# EasyEDA schematic 1-Schematic_VineBox.json
TITLE: VineBox; REV: 2.0; Date: 2019-12-05; Sheet: 1/1; Drawn By: Lagodish; Company: Lagodish inc.
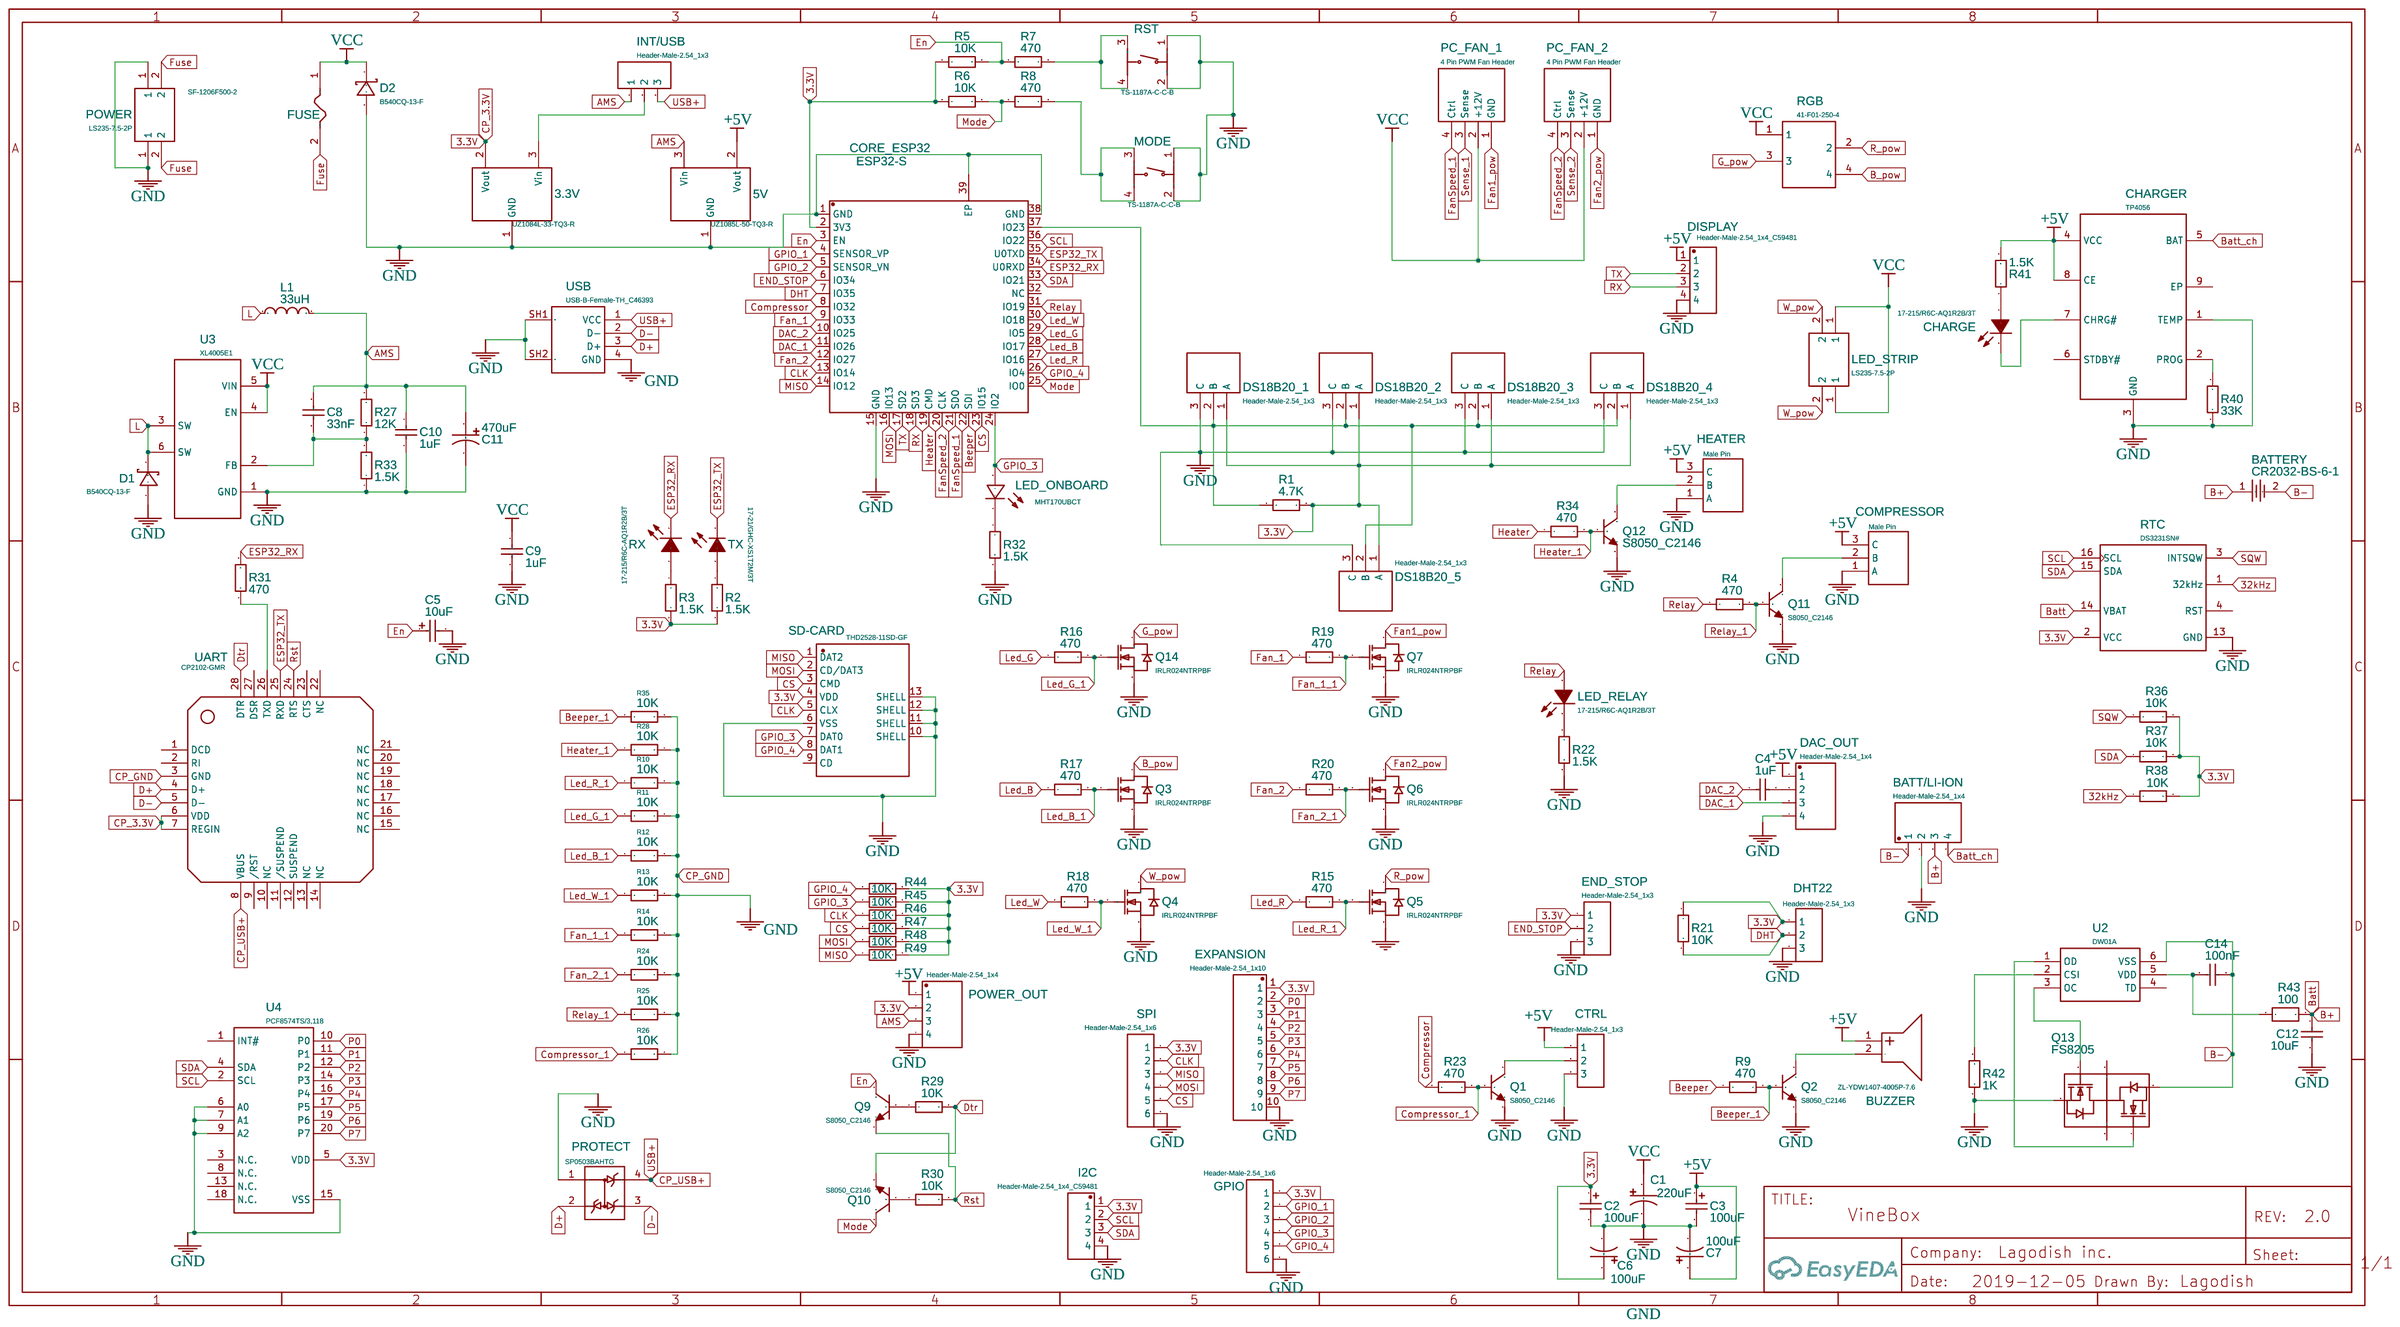
[diagram p0: schematic sheet]

## Parts
3.3V  UZ1084L-33-TQ3-R  [TO-263-3_L8.6-W10.2-P2.54-LS14.4-BR]
5V  UZ1085L-50-TQ3-R  [TO-263-3_L8.6-W10.2-P2.54-LS14.4-BR]
BATT/LI-ION  Header-Male-2.54_1x4  [210S-1X4P]
BATTERY  CR2032-BS-6-1  [BAT-TH_CR2032-BS-6-1]
BUZZER  ZL-YDW1407-4005P-7.6  [BUZ-TH_BD14.0-P7.60-D0.7-FD]
C1  220uF  [CAP-SMD_BD10.0-L10.3-W10.3-FD]
C2  100uF  [CAP-SMD_L3.5-W2.8]
C3  100uF  [CAP-SMD_L3.5-W2.8]
C4  1uF  [0805]
C5  10uF  [CAP-SMD_L3.2-W1.6-R-RD]
C6  100uF  [CAP-SMD_BD6.3-L6.6-W6.6-FD]
C7  100uF  [CAP-SMD_BD6.3-L6.6-W6.6-FD]
C8  33nF  [0805]
C9  1uF  [0805]
C10  1uF  [0805]
C11  470uF  [CAP-SMD_BD10.0-L10.3-W10.3-FD]
C12  10uF  [0805]
C14  100nF  [0805]
CHARGE  17-215/R6C-AQ1R2B/3T  [LED0805-R-RD]
CHARGER  TP4056  [ESOP-8_L4.9-W3.9-P1.27-LS6.0-BL-EP]
COMPRESSOR  Male Pin  [3 PIN HEADER]
CORE_ESP32  ESP32-S  [ESP32-S]
CTRL  Header-Male-2.54_1x3  [HDR-TH_3P-P2.54-V]
D1  B540CQ-13-F  [SMC_L6.9-W5.9-LS7.9-RD]
D2  B540CQ-13-F  [SMC_L6.9-W5.9-LS7.9-RD]
DAC_OUT  Header-Male-2.54_1x4  [210S-1X4P]
DHT22  Header-Male-2.54_1x3  [HDR-TH_3P-P2.54-V]
DISPLAY  Header-Male-2.54_1x4_C59481  [HDR-TH_4P-P2.54-V]
DS18B20_1  Header-Male-2.54_1x3  [3 PIN HEADER]
DS18B20_2  Header-Male-2.54_1x3  [3 PIN HEADER]
DS18B20_3  Header-Male-2.54_1x3  [3 PIN HEADER]
DS18B20_4  Header-Male-2.54_1x3  [3 PIN HEADER]
DS18B20_5  Header-Male-2.54_1x3  [3 PIN HEADER]
END_STOP  Header-Male-2.54_1x3  [HDR-TH_3P-P2.54-V]
EXPANSION  Header-Male-2.54_1x10  [HDR-TH_10P-P2.54-V]
FUSE  SF-1206F500-2  [1206]
GPIO  Header-Male-2.54_1x6  [HDR-TH_6P-P2.54-V]
HEATER  Male Pin  [3 PIN HEADER]
I2C  Header-Male-2.54_1x4_C59481  [HDR-TH_4P-P2.54-V]
INT/USB  Header-Male-2.54_1x3  [HDR-TH_3P-P2.54-V]
L1  33uH  [IND-SMD_L12.5-W12.5]
LED_ONBOARD  MHT170UBCT  [LED0805-RD]
LED_RELAY  17-215/R6C-AQ1R2B/3T  [LED0805-R-RD]
LED_STRIP  LS235-7.5-2P  [CON-TH_2P_LS235-7.5-2P]
MODE  TS-1187A-C-C-B  [SW-SMD_4P-L5.1-W5.1-P3.70-LS6.4]
PC_FAN_1  4 Pin PWM Fan Header  [4 PIN PWM FAN HEADER]
PC_FAN_2  4 Pin PWM Fan Header  [4 PIN PWM FAN HEADER]
POWER  LS235-7.5-2P  [CON-TH_2P_LS235-7.5-2P]
POWER_OUT  Header-Male-2.54_1x4  [210S-1X4P]
PROTECT  SP0503BAHTG  [SOT-143_4PIN_L3.05-W2.64-PITCH1.92-BR]
Q1  S8050_C2146  [SOT-23-3_L3.0-W1.7-P0.95-LS2.9-BR]
Q2  S8050_C2146  [SOT-23-3_L3.0-W1.7-P0.95-LS2.9-BR]
Q3  IRLR024NTRPBF  [TO-252-2]
Q4  IRLR024NTRPBF  [TO-252-2]
Q5  IRLR024NTRPBF  [TO-252-2]
Q6  IRLR024NTRPBF  [TO-252-2]
Q7  IRLR024NTRPBF  [TO-252-2]
Q9  S8050_C2146  [SOT-23-3_L3.0-W1.7-P0.95-LS2.9-BR]
Q10  S8050_C2146  [SOT-23-3_L3.0-W1.7-P0.95-LS2.9-BR]
Q11  S8050_C2146  [SOT-23-3_L3.0-W1.7-P0.95-LS2.9-BR]
Q12  S8050_C2146  [SOT-23-3_L3.0-W1.7-P0.95-LS2.9-BR]
Q13  FS8205  [SOT-23-6]
Q14  IRLR024NTRPBF  [TO-252-2]
R1  4.7K  [0805]
R2  1.5K  [0805]
R3  1.5K  [0805]
R4  470  [0805]
R5  10K  [0805]
R6  10K  [0805]
R7  470  [0805]
R8  470  [0805]
R9  470  [0805]
R10  10K  [0805]
R11  10K  [0805]
R12  10K  [0805]
R13  10K  [0805]
R14  10K  [0805]
R15  470  [0805]
R16  470  [0805]
R17  470  [0805]
R18  470  [0805]
R19  470  [0805]
R20  470  [0805]
R21  10K  [0805]
R22  1.5K  [0805]
R23  470  [0805]
R24  10K  [0805]
R25  10K  [0805]
R26  10K  [0805]
R27  12K  [0805]
R28  10K  [0805]
R29  10K  [0805]
R30  10K  [0805]
R31  470  [0805]
R32  1.5K  [0805]
R33  1.5K  [0805]
R34  470  [0805]
R35  10K  [0805]
R36  10K  [0805]
R37  10K  [0805]
R38  10K  [0805]
R40  33K  [0805]
R41  1.5K  [0805]
R42  1K  [0805]
R43  100  [RES_1206]
R44  10K  [0805]
R45  10K  [0805]
R46  10K  [0805]
R47  10K  [0805]
R48  10K  [0805]
R49  10K  [0805]
RGB  41-F01-250-4  [CONN-TH_41-F01-250-4]
RST  TS-1187A-C-C-B  [SW-SMD_4P-L5.1-W5.1-P3.70-LS6.4]
RTC  DS3231SN#  [SOIC-16_300MIL]
RX  17-215/R6C-AQ1R2B/3T  [LED0805-R-RD]
SD-CARD  THD2528-11SD-GF  [TF-SMD_9PIN_THD2528-11SD-GF_PITCH1.1-TR]
SPI  Header-Male-2.54_1x6  [HDR-TH_6P-P2.54-V]
TX  17-21/GHC-XS1T2M/3T  [LED0805-R-RD]
U2  DW01A  [SOT-23-6]
U3  XL4005E1  [TO-263-5]
U4  PCF8574TS/3,118  [SSOP-20_20PIN-L6.60-W6.60-PITCH0.65-BL]
UART  CP2102-GMR  [QFN-28_5X5X05P]
USB  USB-B-Female-TH_C46393  [USB-B_4PIN-FEMALE_BF90]

## Library data of the parts
3.3V = -: Supplier: LCSC; Manufacturer: UTC; image: //image.lceda.cn/szlcsc/C75489.jpg; Supplier Part: C75489; LCSC Assembly: Yes; SMT Type: Extend
5V = -: Supplier: LCSC; Manufacturer: UTC; image: //image.lceda.cn/szlcsc/C75492.jpg; Supplier Part: C75492; LCSC Assembly: Yes; SMT Type: Extend
BATT/LI-ION DAC_OUT POWER_OUT = -: Supplier: LCSC; Manufacturer: Ckmtw; Manufacturer Part: 210S-1*4P L=11.6MMGold-plated black; Contributor: LCSC; Supplier Part: C124378
BATTERY = -: Supplier: LCSC; Manufacturer: Q&J; image: //image.lceda.cn/szlcsc/C70377.jpg; Supplier Part: C70377
BUZZER = -: Supplier: LCSC; Supplier Part: C219740; Manufacturer: ZLFY; Contributor: LCSC
C1 = OVG221M1E1010-TRO: Supplier: LCSC; Supplier Part: C250054; Manufacturer: Lelon; Contributor: LCSC
C2 C3 = TAJB107K006RNJ: Supplier: LCSC; Manufacturer: AVX; LCSC Assembly: Yes; Supplier Part: C16133; SMT Type: Basic
C4 C9 C10 = CL21B105KBFNNNE: Supplier: LCSC; Manufacturer: SAMSUNG; LCSC Assembly: Yes; Supplier Part: C28323; SMT Type: Basic
C5 = TAJA106K016RNJ: Supplier: LCSC; Manufacturer: AVX; LCSC Assembly: Yes; Supplier Part: C7171; SMT Type: Basic
C6 C7 = OCV101M0JTR-0606: Supplier: LCSC; Manufacturer: LELON; Contributor: LCSC; Supplier Part: C134854
C8 = 0805B333K500NT: Supplier: LCSC; Manufacturer: FH; LCSC Assembly: Yes; Supplier Part: C1739; SMT Type: Basic
C11 = OVZ471M1A1008-TRO: Supplier: LCSC; Supplier Part: C250114; Manufacturer: Lelon; Contributor: LCSC
C12 = CL21A106KAYNNNE: Supplier: LCSC; Manufacturer: SAMSUNG; LCSC Assembly: Yes; Supplier Part: C15850; SMT Type: Basic
C14 = CL21B104KCFNNNE: Supplier: LCSC; Manufacturer: SAMSUNG; Supplier Part: C28233; LCSC Assembly: Yes; SMT Type: Extend
CHARGE LED_RELAY RX = -: Supplier: LCSC; Manufacturer: EVERLIGHT; Supplier Part: C86865; LCSC Assembly: Yes; SMT Type: Extend
CHARGER = -: Contributor: Guest; Supplier: LCSC; Manufacturer: TOPPOWER; LCSC Assembly: Yes; image: //image.lceda.cn/szlcsc/C16581.jpg; Supplier Part: C16581; SMT Type: Basic
COMPRESSOR DS18B20_1-DS18B20_5 HEATER = -: Manufacturer Part: 3 pin header; Contributor: Deimoss; Supplier Part: C49257
CORE_ESP32 = -: Supplier: LCSC; Supplier Part: C277944; Manufacturer: Ai-Thinker; Contributor: LCSC
CTRL DHT22 END_STOP INT/USB = -: Supplier: LCSC; Manufacturer: BOOMELE; Manufacturer Part: Header2.54mm 1*3P; image: //image.lceda.cn/szlcsc/C49257.jpg; Supplier Part: C49257
D1 D2 = -: Supplier Part: C105556; Supplier: LCSC; Manufacturer: DIODES; Contributor: LCSC; LCSC Assembly: Yes; SMT Type: Extend
DISPLAY I2C = -: Supplier: LCSC; Manufacturer: ReliaPro; Manufacturer Part: Headers  Pins 1*4P; image: http://image.lceda.cn/szlcsc/C59481.jpg; Supplier Part: C124378
EXPANSION = -: Supplier: LCSC; Manufacturer Part: Headers  Pins2.54mm1*10P; image: http://image.lceda.cn/szlcsc/C57369.jpg; Supplier Part: C57369
FUSE = -: Supplier: LCSC; Manufacturer: BOURNS; image: //image.lceda.cn/szlcsc/C48332.jpg; Supplier Part: C48332; LCSC Assembly: Yes; SMT Type: Extend
GPIO SPI = -: Supplier: LCSC; Manufacturer: BOOMELE; Supplier Part: C37208
L1 = SWRB1207S-330MT: Supplier: LCSC; Supplier Part: C169375; Manufacturer: Sunlord; Contributor: LCSC
LED_ONBOARD = -: Supplier: LCSC; Supplier Part: C389525; Manufacturer: MEIHUA; Contributor: LCSC
LED_STRIP POWER = -: Supplier: LCSC; Supplier Part: C165215; Manufacturer: Shanghai Elinker Elec; Contributor: LCSC
MODE RST = -: Supplier: LCSC; Supplier Part: C318889; Manufacturer: XKB Enterprise; Contributor: LCSC
PC_FAN_1 PC_FAN_2 = -: Supplier Part: C49257; Contributor: reakevin.05
PROTECT = -: Supplier: LCSC; Manufacturer: Littelfuse; image: //image.lceda.cn/szlcsc/C7074.jpg; Supplier Part: C7074
Q1 Q2 Q9-Q12 = -: Supplier: LCSC; Manufacturer: CJ; Manufacturer Part: S8050; image: //image.lceda.cn/szlcsc/C2146.jpg; Supplier Part: C2146; LCSC Assembly: Yes; SMT Type: Basic
Q3-Q7 Q14 = -: Supplier: LCSC; Manufacturer: Infineon; image: //image.lceda.cn/szlcsc/C3007.jpg; Supplier Part: C3007; LCSC Assembly: Yes; SMT Type: Extend
Q13 = -: Supplier: LCSC; Manufacturer: FORTUNE; LCSC Assembly: Yes; image: //image.lceda.cn/szlcsc/C32254.jpg; Supplier Part: C32254; SMT Type: Basic
R1 = 0805W8F4701T5E: Supplier: LCSC; Manufacturer: UniOhm; LCSC Assembly: Yes; Supplier Part: C17673; SMT Type: Basic
R2 R3 R22 R32 R41 = 0805W8F1501T5E: Supplier: LCSC; Manufacturer: UniOhm; LCSC Assembly: Yes; Supplier Part: C4310; SMT Type: Basic
R4 R7-R9 R15-R20 R23 R31 R34 = 0805W8F4700T5E: Supplier: LCSC; Manufacturer: UniOhm; LCSC Assembly: Yes; Supplier Part: C17710; SMT Type: Basic
R5 R6 R10-R14 R21 R24-R26 R28-R30 R35-R38 R44-R49 = 0805W8F1002T5E: Supplier: LCSC; Manufacturer: UniOhm; LCSC Assembly: Yes; Supplier Part: C17414; SMT Type: Basic
R27 = RS-05K1202FT: Supplier: LCSC; Manufacturer: FH; Contributor: LCSC; Supplier Part: C136575
R33 = RS-05K152JT: Supplier: LCSC; Supplier Part: C304820; Manufacturer: Guangdong Fenghua Advanced Tech; Contributor: LCSC
R40 = 0805W8F3302T5E: Supplier: LCSC; Manufacturer: UniOhm; LCSC Assembly: Yes; Supplier Part: C17633; SMT Type: Basic
R42 = 0805W8F1001T5E: Supplier: LCSC; Manufacturer: UniOhm; LCSC Assembly: Yes; Supplier Part: C17513; SMT Type: Basic
R43 = SYLE1206JN100RP: Supplier: LCSC; Supplier Part: C385916; Manufacturer: SANYEAR; Contributor: LCSC
RGB = -: Supplier: LCSC; Supplier Part: C173392; Manufacturer: HIWA; Contributor: LCSC
RTC = -: tags: Clock; Supplier Part: C9866; Supplier: LCSC; Manufacturer: MAXIM; Manufacturer Part: DS3231SN; subpart_no: 1; image: http://image.lceda.cn/szlcsc/C9866.jpg
SD-CARD = -: Supplier: LCSC; Supplier Part: C283232; Manufacturer: THD; Contributor: LCSC
TX = -: Supplier: LCSC; Manufacturer: EVERLIGHT; image: //image.lceda.cn/szlcsc/C63855.jpg; Supplier Part: C63855; LCSC Assembly: Yes; SMT Type: Extend
U2 = -: Supplier: LCSC; Manufacturer: FM; Supplier Part: C61503; LCSC Assembly: Yes; SMT Type: Extend
U3 = -: Supplier: LCSC; Manufacturer: XLSEMI; image: //image.lceda.cn/szlcsc/C73332.jpg; Supplier Part: C73332; LCSC Assembly: Yes; SMT Type: Extend
U4 = -: Supplier: LCSC; Manufacturer: NXP; image: //image.lceda.cn/szlcsc/C57790.jpg; Supplier Part: C57790; LCSC Assembly: Yes; SMT Type: Extend
UART = -: Supplier: LCSC; Manufacturer: SILICON LABS; LCSC Assembly: Yes; image: //image.lceda.cn/szlcsc/C6568.jpg; Supplier Part: C6568; SMT Type: Basic
USB = -: Supplier: LCSC; Manufacturer Part: USB-B-Female-90-TH; image: //image.lceda.cn/szlcsc/C46393.jpg; Supplier Part: C46393

## Nets
3.3V: 3.3V.2(Vout) C2.1 C6.1 CORE_ESP32.2(3V3) DHT22.1 DS18B20_1.1(A) DS18B20_2.1(A) DS18B20_3.1(A) DS18B20_4.1(A) DS18B20_5.1(A) END_STOP.1 EXPANSION.1 GPIO.1 I2C.1 POWER_OUT.2 R1.2 R2.2 R3.2 R5.1 R6.1 R21.1 R36.2 R37.2 R38.2 R44.2 R45.2 R46.2 R47.2 R48.2 R49.2 RTC.2(VCC) SD-CARD.4(VDD) SPI.1 U4.5(VDD) UART.6(VDD) UART.7(REGIN)
+5V: 5V.2(Vout) BUZZER.1(+) C3.1 C7.1 CHARGER.4(VCC) CHARGER.8(CE) COMPRESSOR.3(C) CTRL.1 DAC_OUT.1 DISPLAY.1 HEATER.3(C) POWER_OUT.1 R41.2
VCC: C1.1 C9.1 D2.1(C) FUSE.1 LED_STRIP.1 PC_FAN_1.2(+12V) PC_FAN_2.2(+12V) RGB.1 U3.4(EN) U3.5(VIN)
32kHz: R38.1 RTC.1(32kHz)
AMS: 5V.3(Vin) C8.2 C10.1 C11.1 INT/USB.1 L1.2 POWER_OUT.3 R27.2
B+: BATT/LI-ION.3 BATTERY.1 C12.1 R43.2 RTC.14(VBAT)
B-: BATT/LI-ION.1 BATTERY.2 C14.2 Q13.3(S2) U2.6(VSS)
B_pow: Q3.4(D) RGB.4
Batt_ch: BATT/LI-ION.4 CHARGER.5(BAT)
Beeper: CORE_ESP32.22(SDI) R9.1
Beeper_1: Q2.1(B) R9.2 R35.1
CLK: CORE_ESP32.13(IO14) R46.1 SD-CARD.5(CLX) SPI.2
Compressor: CORE_ESP32.8(IO32) R23.1
Compressor_1: Q1.1(B) R23.2 R26.1
CP_GND: 3.3V.1(GND) 5V.1(GND) BATT/LI-ION.2 C1.2 C2.2 C3.2 C5.2 C6.2 C7.2 C9.2 C10.2 C11.2 C12.2 CHARGER.1(TEMP) CHARGER.3(GND) COMPRESSOR.1(A) CORE_ESP32.1(GND) CORE_ESP32.15(GND) CORE_ESP32.38(GND) CORE_ESP32.39(EP) CTRL.3 D1.2(A) D2.2(A) DAC_OUT.4 DHT22.3 DISPLAY.4 DS18B20_1.3(C) DS18B20_2.3(C) DS18B20_3.3(C) DS18B20_4.3(C) DS18B20_5.3(C) END_STOP.3 EXPANSION.10 GPIO.6 HEATER.1(A) I2C.4 MODE.1(A) MODE.2(B) POWER.1 POWER_OUT.4 PROTECT.1 Q1.2(E) Q2.2(E) Q3.3(S) Q4.3(S) Q5.3(S) Q6.3(S) Q7.3(S) Q11.2(E) Q12.2(E) Q13.1(S1) Q14.3(S) R10.2 R11.2 R12.2 R13.2 R14.2 R22.2 R24.2 R25.2 R26.2 R28.2 R32.2 R33.1 R35.2 R40.2 R42.1 RST.1(A) RST.2(B) RTC.13(GND) SD-CARD.6(VSS) SD-CARD.10(SHELL) SD-CARD.11(SHELL) SD-CARD.12(SHELL) SD-CARD.13(SHELL) SPI.6 U3.1(GND) U4.6(A0) U4.7(A1) U4.9(A2) U4.15(VSS) UART.3(GND) USB.4(GND) USB.SH1 USB.SH2
CP_USB+: INT/USB.3 PROTECT.4 UART.8(VBUS) USB.1(VCC)
CS: CORE_ESP32.23(IO15) R47.1 SD-CARD.3(CMD) SPI.5
D+: PROTECT.2 UART.4(D+) USB.3(D+)
D-: PROTECT.3 UART.5(D-) USB.2(D-)
DAC_1: CORE_ESP32.11(IO26) DAC_OUT.3
DAC_2: C4.1 CORE_ESP32.10(IO25)
DHT: CORE_ESP32.7(IO35) DHT22.2 R21.2
Dtr: Q10.2(E) R29.2 UART.28(DTR)
En: C5.1 CORE_ESP32.3(EN) Q9.3(C) R5.2 R7.1
END_STOP: CORE_ESP32.6(IO34) END_STOP.2
ESP32_RX: CORE_ESP32.34(U0RXD) R31.2 RX.2(-)
ESP32_TX: CORE_ESP32.35(U0TXD) TX.2(C) UART.25(RXD)
Fan1_pow: PC_FAN_1.1(GND) Q7.4(D)
Fan2_pow: PC_FAN_2.1(GND) Q6.4(D)
Fan_1: CORE_ESP32.9(IO33) R19.1
Fan_1_1: Q7.1(G) R14.1 R19.2
Fan_2: CORE_ESP32.12(IO27) R20.1
Fan_2_1: Q6.1(G) R20.2 R24.1
FanSpeed_1: CORE_ESP32.21(SDO) PC_FAN_1.4(Ctrl)
FanSpeed_2: CORE_ESP32.20(CLK) PC_FAN_2.4(Ctrl)
Fuse: FUSE.2 POWER.2
G_pow: Q14.4(D) RGB.3
GPIO_1: CORE_ESP32.4(SENSOR_VP) GPIO.2
GPIO_2: CORE_ESP32.5(SENSOR_VN) GPIO.3
GPIO_3: CORE_ESP32.24(IO2) GPIO.4 LED_ONBOARD.2(+) R45.1 SD-CARD.7(DAT0)
GPIO_4: CORE_ESP32.26(IO4) GPIO.5 R44.1 SD-CARD.8(DAT1)
Heater: CORE_ESP32.19(CMD) R34.1
Heater_1: Q12.1(B) R28.1 R34.2
L: D1.1(C) L1.1 U3.3(SW) U3.6(SW)
Led_B: CORE_ESP32.28(IO17) R17.1
Led_B_1: Q3.1(G) R12.1 R17.2
Led_G: CORE_ESP32.29(IO5) R16.1
Led_G_1: Q14.1(G) R11.1 R16.2
Led_R: CORE_ESP32.27(IO16) R15.1
Led_R_1: Q5.1(G) R10.1 R15.2
Led_W: CORE_ESP32.30(IO18) R18.1
Led_W_1: Q4.1(G) R13.1 R18.2
MISO: CORE_ESP32.14(IO12) R49.1 SD-CARD.1(DAT2) SPI.3
Mode: CORE_ESP32.25(IO0) Q10.3(C) R6.2 R8.1
MOSI: CORE_ESP32.16(IO13) R48.1 SD-CARD.2(CD/DAT3) SPI.4
P0: EXPANSION.2 U4.10(P0)
P1: EXPANSION.3 U4.11(P1)
P2: EXPANSION.4 U4.12(P2)
P3: EXPANSION.5 U4.14(P3)
P4: EXPANSION.6 U4.16(P4)
P5: EXPANSION.7 U4.17(P5)
P6: EXPANSION.8 U4.19(P6)
P7: EXPANSION.9 U4.20(P7)
R_pow: Q5.4(D) RGB.2
Relay: CORE_ESP32.31(IO19) LED_RELAY.1(+) R4.1
Relay_1: Q11.1(B) R4.2 R25.1
Rst: Q9.2(E) R30.2 UART.24(RTS)
RX: CORE_ESP32.18(SD3) DISPLAY.3
SCL: CORE_ESP32.36(IO22) I2C.2 RTC.16(SCL) U4.2(SCL)
SDA: CORE_ESP32.33(IO21) I2C.3 R37.1 RTC.15(SDA) U4.4(SDA)
Sense_1: PC_FAN_1.3(Sense)
Sense_2: PC_FAN_2.3(Sense)
SQW: R36.1 RTC.3(INTSQW)
TX: CORE_ESP32.17(SD2) DISPLAY.2
W_pow: LED_STRIP.2 Q4.4(D)
3.3V_3: 3.3V.3(Vin) INT/USB.2
BUZZER_2: BUZZER.2(-) Q2.3(C)
CHARGE_1: CHARGE.1(+) R41.1
CHARGER_2: CHARGER.2(PROG) R40.1
CHARGER_7: CHARGE.2(-) CHARGER.7(CHRG#)
COMPRESSOR_2: COMPRESSOR.2(B) Q11.3(C)
CORE_ESP32_37: CORE_ESP32.37(IO23) DS18B20_1.2(B) DS18B20_2.2(B) DS18B20_3.2(B) DS18B20_4.2(B) DS18B20_5.2(B) R1.1
CTRL_2: CTRL.2 Q1.3(C)
DAC_OUT_2: C4.2 DAC_OUT.2
LED_ONBOARD_1: LED_ONBOARD.1(-) R32.1
LED_RELAY_2: LED_RELAY.2(-) R22.1
MODE_3: MODE.3(C) MODE.4(D) R8.2
Net-(C8-1): C8.1 R27.1 R33.2 U3.2(FB)
Q12_3: HEATER.2(B) Q12.3(C)
R2_1: R2.1 TX.1(A)
R3_1: R3.1 RX.1(+)
R29_1: Q9.1(B) R29.1
R30_1: Q10.1(B) R30.1
RST_3: R7.2 RST.3(C) RST.4(D)
U2_1: Q13.4(G2) U2.1(OD)
U2_2: R42.2 U2.2(CSI)
U2_3: Q13.6(G1) U2.3(OC)
U2_5: C14.1 R43.1 U2.5(VDD)
UART_26: R31.1 UART.26(TXD)

Not connected (* = marked no-connect by the designer): CHARGER 6(STDBY#) 9(EP); CORE_ESP32 32(NC); Q13 2(D12) 5(D12); RTC 4(RST); SD-CARD 9(CD); U2 4(TD); U4 1(INT#) 3(N.C.) 8(N.C.) 13(N.C.) 18(N.C.); UART 1(DCD) 2(RI) 9(/RST) 10(NC) 11(/SUSPEND) 12(SUSPEND) 13(NC) 14(NC) 15(NC) 16(NC) 17(NC) 18(NC) 19(NC) 20(NC) 21(NC) 22(NC) 23(CTS) 27(DSR)
